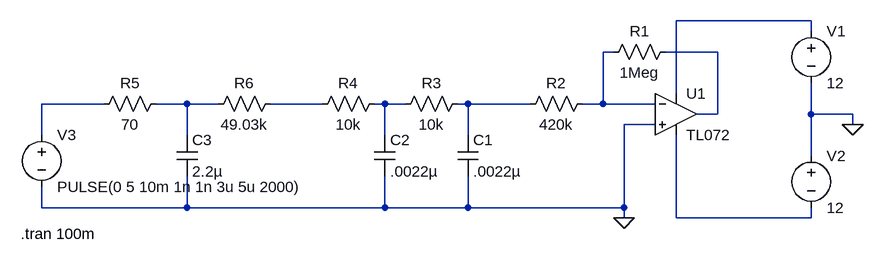
[diagram p0: schematic anti-alias-filter.asc]
anti-alias-filter.asc, the LTspice schematic file:
Version 4
SHEET 1 880 680
WIRE 480 32 272 32
WIRE 480 48 480 32
WIRE 176 80 160 80
WIRE 336 80 256 80
WIRE 272 144 272 32
WIRE -608 160 -704 160
WIRE -480 160 -528 160
WIRE -432 160 -480 160
WIRE -272 160 -352 160
WIRE -176 160 -192 160
WIRE -144 160 -176 160
WIRE -48 160 -64 160
WIRE 48 160 -48 160
WIRE 160 160 160 80
WIRE 160 160 128 160
WIRE 240 160 160 160
WIRE 336 176 336 80
WIRE 336 176 304 176
WIRE 480 176 480 128
WIRE 544 176 480 176
WIRE 240 192 192 192
WIRE 544 192 544 176
WIRE -704 208 -704 160
WIRE -480 208 -480 160
WIRE -176 208 -176 160
WIRE -48 208 -48 160
WIRE 480 240 480 176
WIRE -704 320 -704 288
WIRE -480 320 -480 272
WIRE -480 320 -704 320
WIRE -176 320 -176 272
WIRE -176 320 -480 320
WIRE -48 320 -48 272
WIRE -48 320 -176 320
WIRE 192 320 192 192
WIRE 192 320 -48 320
WIRE 192 336 192 320
WIRE 272 336 272 208
WIRE 480 336 480 320
WIRE 480 336 272 336
FLAG 544 192 0
FLAG 192 336 0
SYMBOL TL072 272 112 R0
SYMATTR InstName U1
SYMBOL voltage 480 32 R0
WINDOW 123 0 0 Left 0
WINDOW 39 0 0 Left 0
SYMATTR InstName V1
SYMATTR Value 12
SYMBOL voltage 480 224 R0
WINDOW 123 0 0 Left 0
WINDOW 39 0 0 Left 0
SYMATTR InstName V2
SYMATTR Value 12
SYMBOL res 272 64 R90
WINDOW 0 0 56 VBottom 2
WINDOW 3 32 56 VTop 2
SYMATTR InstName R1
SYMATTR Value 1Meg
SYMBOL res 144 144 R90
WINDOW 0 0 56 VBottom 2
WINDOW 3 32 56 VTop 2
SYMATTR InstName R2
SYMATTR Value 420k
SYMBOL cap -64 208 R0
SYMATTR InstName C1
SYMATTR Value .0022µ
SYMBOL cap -192 208 R0
SYMATTR InstName C2
SYMATTR Value .0022µ
SYMBOL cap -496 208 R0
SYMATTR InstName C3
SYMATTR Value 2.2µ
SYMBOL res -48 144 R90
WINDOW 0 0 56 VBottom 2
WINDOW 3 32 56 VTop 2
SYMATTR InstName R3
SYMATTR Value 10k
SYMBOL res -176 144 R90
WINDOW 0 0 56 VBottom 2
WINDOW 3 32 56 VTop 2
SYMATTR InstName R4
SYMATTR Value 10k
SYMBOL res -512 144 R90
WINDOW 0 0 56 VBottom 2
WINDOW 3 32 56 VTop 2
SYMATTR InstName R5
SYMATTR Value 70
SYMBOL voltage -704 192 R0
WINDOW 123 0 0 Left 0
WINDOW 39 0 0 Left 0
SYMATTR InstName V3
SYMATTR Value PULSE(0 5 10m 1n 1n 3u 5u 2000)
SYMBOL res -336 144 R90
WINDOW 0 0 56 VBottom 2
WINDOW 3 32 56 VTop 2
SYMATTR InstName R6
SYMATTR Value 49.03k
TEXT -736 360 Left 2 !.tran 100m

The netlist it stands for:
* anti-alias-filter.asc
* U1: TL072 (symbol TL072 not available, pins judged from their places): In+=0 In-=N002 V+=N001 V-=N009 OUT=N003
V1 N001 0 12
V2 0 N009 12
R1 N003 N002 1Meg
R2 N002 N008 420k
C1 N008 0 .0022µ
C2 N007 0 .0022µ
C3 N005 0 2.2µ
R3 N008 N007 10k
R4 N007 N006 10k
R5 N005 N004 70
V3 N004 0 PULSE(0 5 10m 1n 1n 3u 5u 2000)
R6 N006 N005 49.03k
.tran 100m
.backanno
.end